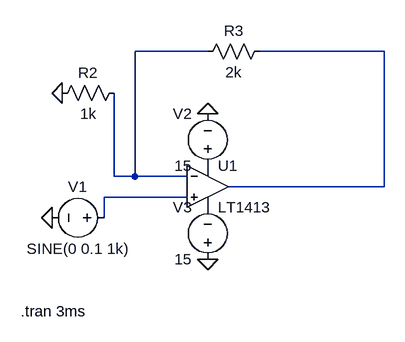
[diagram p0: schematic EXP-5_NonInvertingOPAMP.asc]
EXP-5_NonInvertingOPAMP.asc, the LTspice schematic file:
Version 4
SHEET 1 880 680
WIRE 192 -16 80 -16
WIRE 464 -16 272 -16
WIRE 48 176 48 48
WIRE 80 176 80 -16
WIRE 80 176 48 176
WIRE 160 176 80 176
WIRE 464 192 464 -16
WIRE 464 192 224 192
WIRE 160 208 32 208
WIRE 32 240 32 208
FLAG -32 48 0
FLAG -48 240 0
FLAG 192 80 0
FLAG 192 304 0
SYMBOL voltage 48 240 R90
WINDOW 0 -32 56 VBottom 2
WINDOW 3 32 56 VTop 2
WINDOW 123 0 0 Left 0
WINDOW 39 0 0 Left 0
SYMATTR InstName V1
SYMATTR Value SINE(0 0.1 1k)
SYMBOL res 64 32 R90
WINDOW 0 0 56 VBottom 2
WINDOW 3 32 56 VTop 2
SYMATTR InstName R2
SYMATTR Value 1k
SYMBOL res 288 -32 R90
WINDOW 0 0 56 VBottom 2
WINDOW 3 32 56 VTop 2
SYMATTR InstName R3
SYMATTR Value 2k
SYMBOL OpAmps\\LT1413 192 128 R0
SYMATTR InstName U1
SYMBOL voltage 192 176 R180
WINDOW 0 24 96 Left 2
WINDOW 3 24 16 Left 2
WINDOW 123 0 0 Left 0
WINDOW 39 0 0 Left 0
SYMATTR InstName V2
SYMATTR Value 15
SYMBOL voltage 192 320 R180
WINDOW 0 24 96 Left 2
WINDOW 3 24 16 Left 2
WINDOW 123 0 0 Left 0
WINDOW 39 0 0 Left 0
SYMATTR InstName V3
SYMATTR Value 15
TEXT -96 384 Left 2 !.tran 3ms

The netlist it stands for:
* EXP-5_NonInvertingOPAMP.asc
V1 N003 0 SINE(0 0.1 1k)
R2 N001 0 1k
R3 N002 N001 2k
XU1 N003 N001 P001 P002 N002 LT1413  ; pins In+ In- V+ V- OUT
V2 P001 0 15
V3 0 P002 15
.tran 3ms
.lib LTC.lib
.backanno
.end